# Altium schematic sheet Multi_Pitch_Sound_Generator_Project.SchDoc
size A4; SheetNumber: 1; SheetTotal: 1
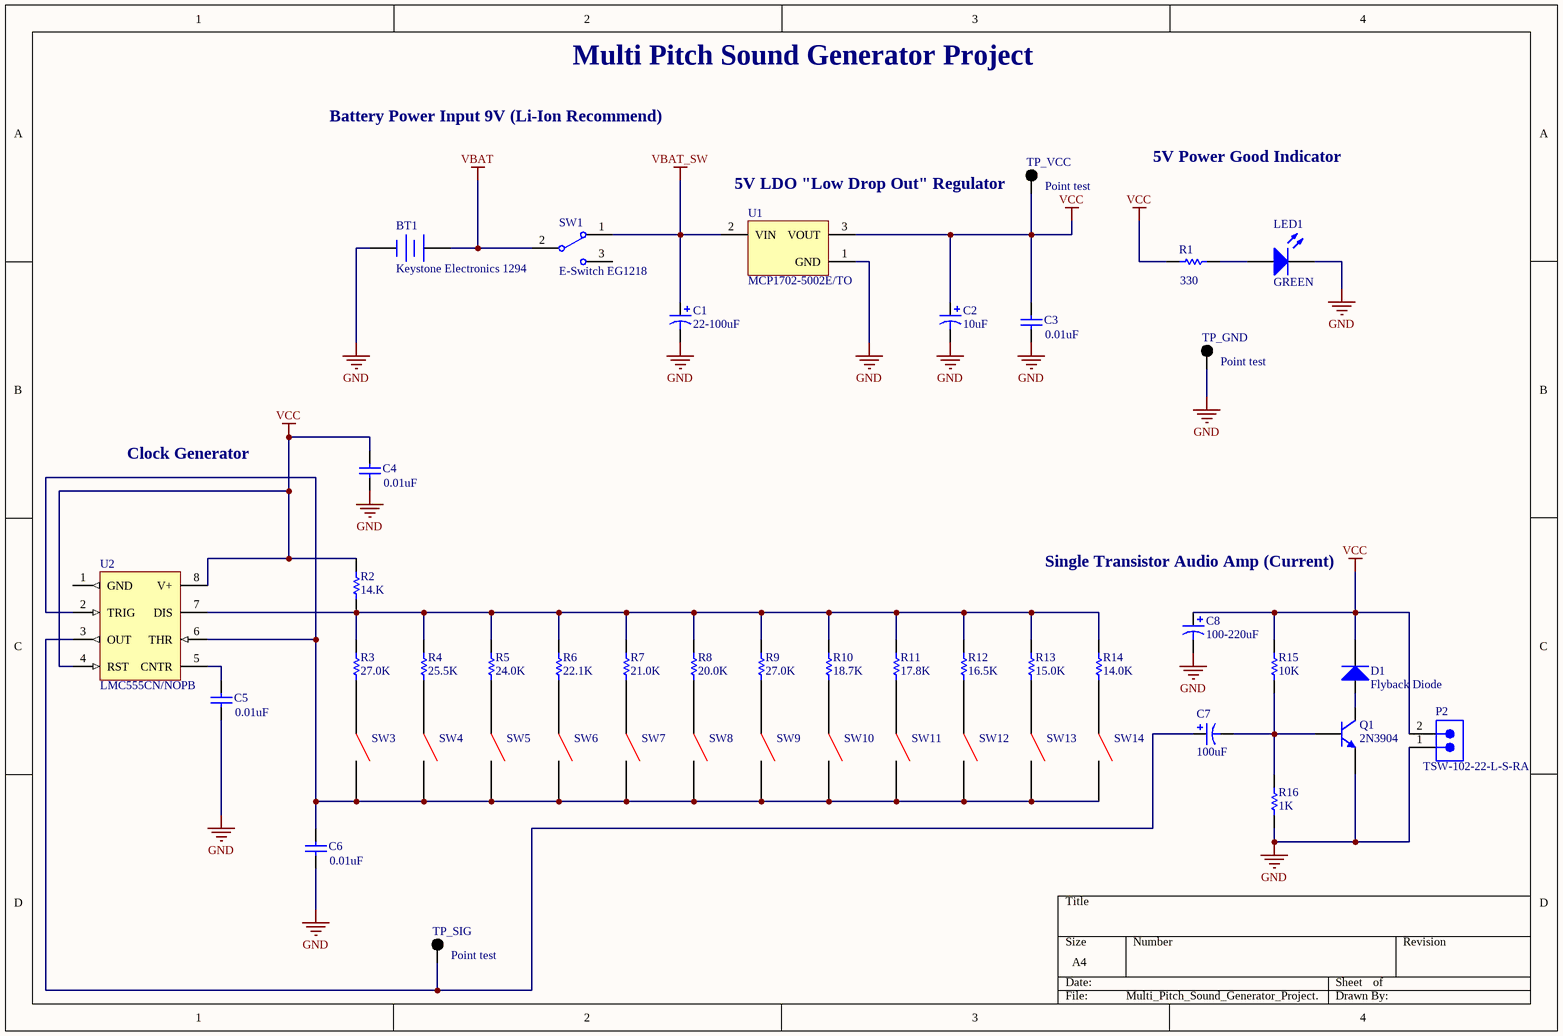
[diagram p0: Multi_Pitch_Sound_Generator_Project.SchDoc]

## Parts
BT1  Keystone Electronics 1294  [PCB-3798-1]
C1  22-100uF  [PCB-nq6yd78wv7rl8ojp8omb-1]
C2  10uF  [PCB-nq6yd78wv7rl8ojp8omb-1]
C3  0.01uF  [PCB-ql28fbuo3tond8refhb5-1]
C4  0.01uF  [PCB-ql28fbuo3tond8refhb5-1]
C5  0.01uF  [PCB-ql28fbuo3tond8refhb5-1]
C6  0.01uF  [PCB-ql28fbuo3tond8refhb5-1]
C7  100uF  [PCB-nq6yd78wv7rl8ojp8omb-1]
C8  100-220uF  [PCB-nq6yd78wv7rl8ojp8omb-1]
D1  Flyback Diode  [PCB-z2ypi7zr74mzpyjelpsh-1]
LED1  GREEN  [PCB-b5vk7vz0xhkw7l0fnova-1]
P2  TSW-102-22-L-S-RA  [SMTC-TSW-102-22-X-S-RA]
Q1  2N3904  [PCB-d52vzgbszc9onplxz1b0-1]
R1  330  [PCB-0jk5y5qyb1smy9vf6b7t-1]
R2  14.K  [PCB-0jk5y5qyb1smy9vf6b7t-1]
R3  27.0K  [PCB-0jk5y5qyb1smy9vf6b7t-1]
R4  25.5K  [PCB-0jk5y5qyb1smy9vf6b7t-1]
R5  24.0K  [PCB-0jk5y5qyb1smy9vf6b7t-1]
R6  22.1K  [PCB-0jk5y5qyb1smy9vf6b7t-1]
R7  21.0K  [PCB-0jk5y5qyb1smy9vf6b7t-1]
R8  20.0K  [PCB-0jk5y5qyb1smy9vf6b7t-1]
R9  27.0K  [PCB-0jk5y5qyb1smy9vf6b7t-1]
R10  18.7K  [PCB-0jk5y5qyb1smy9vf6b7t-1]
R11  17.8K  [PCB-0jk5y5qyb1smy9vf6b7t-1]
R12  16.5K  [PCB-0jk5y5qyb1smy9vf6b7t-1]
R13  15.0K  [PCB-0jk5y5qyb1smy9vf6b7t-1]
R14  14.0K  [PCB-0jk5y5qyb1smy9vf6b7t-1]
R15  10K  [PCB-0jk5y5qyb1smy9vf6b7t-1]
R16  1K  [PCB-0jk5y5qyb1smy9vf6b7t-1]
SW1  E-Switch EG1218  [ESWI-EG1218_V]
SW3  (no value)  [PCB-je10m8m3eogq13l465bo-1]
SW4  (no value)  [PCB-je10m8m3eogq13l465bo-1]
SW5  (no value)  [PCB-je10m8m3eogq13l465bo-1]
SW6  (no value)  [PCB-je10m8m3eogq13l465bo-1]
SW7  (no value)  [PCB-je10m8m3eogq13l465bo-1]
SW8  (no value)  [PCB-je10m8m3eogq13l465bo-1]
SW9  (no value)  [PCB-je10m8m3eogq13l465bo-1]
SW10  (no value)  [PCB-je10m8m3eogq13l465bo-1]
SW11  (no value)  [PCB-je10m8m3eogq13l465bo-1]
SW12  (no value)  [PCB-je10m8m3eogq13l465bo-1]
SW13  (no value)  [PCB-je10m8m3eogq13l465bo-1]
SW14  (no value)  [PCB-je10m8m3eogq13l465bo-1]
TP_GND  Point test  [P1-09]
TP_SIG  Point test  [P1-09]
TP_VCC  Point test  [P1-09]
U1  MCP1702-5002E/TO  [TO-92-TO3]
U2  LMC555CN/NOPB  [TI-D8_L]

## Nets
GND: BT1.2(-) C1.2 C2.2 C3.1 C4.1 C5.1 C6.1 C8.2 LED1.1(K) P2.1 Q1.E R16.2 TP_GND.1 U1.1(GND)
VBAT: BT1.1(+) SW1.2(COM)
VBAT_SW: C1.1 SW1.1 U1.2(VIN)
VCC: C2.1 C3.2 C4.2 C8.1 D1.2(K) P2.2 R1.1 R2.1 R15.1 TP_VCC.1 U1.3(VOUT) U2.4(RST) U2.8(V+)
NetC5_2: C5.2 U2.5(CNTR)
NetC6_2: C6.2 SW3.2 SW4.2 SW5.2 SW6.2 SW7.2 SW8.2 SW9.2 SW10.2 SW11.2 SW12.2 SW13.2 SW14.2 U2.2(TRIG) U2.6(THR)
NetC7_1: C7.1 TP_SIG.1 U2.3(OUT)
NetC7_2: C7.2 Q1.B R15.2 R16.1
NetD1_1: D1.1(A) Q1.C
NetLED1_2: LED1.2(A) R1.2
NetR2_2: R2.2 R3.1 R4.1 R5.1 R6.1 R7.1 R8.1 R9.1 R10.1 R11.1 R12.1 R13.1 R14.1 U2.7(DIS)
NetR3_2: R3.2 SW3.1
NetR4_2: R4.2 SW4.1
NetR5_2: R5.2 SW5.1
NetR6_2: R6.2 SW6.1
NetR7_2: R7.2 SW7.1
NetR8_2: R8.2 SW8.1
NetR9_2: R9.2 SW9.1
NetR10_2: R10.2 SW10.1
NetR11_2: R11.2 SW11.1
NetR12_2: R12.2 SW12.1
NetR13_2: R13.2 SW13.1
NetR14_2: R14.2 SW14.1

Not connected (* = marked no-connect by the designer): SW1 3; U2 1(GND)

## Notes on the sheet
- Multi Pitch Sound Generator Project
- Battery Power Input 9V (Li-Ion Recommend)
- 5V Power Good Indicator
- 5V LDO "Low Drop Out" Regulator
- Clock Generator
- Single Transistor Audio Amp (Current)

## Library data of the parts
BT1 = CMP-3798-4: HOLDER BATT 9V UNIV PLASTIC PC; Manufacturer Part Number: 1294; Lead-Free Status: Lead Free; Number of Contacts: 2; Octopart Url: https://octopart.com/1294-keystone-3743; Material: Plastic; REACH SVHC Compliance: No SVHC; Contact Plating: Nickel; RoHS: Compliant; Packaging: Bulk; OctopartID: fd44344ed6bd2283; Contact Material: Steel
C1 C2 C7 C8 = CMP-119dd9bbe86bce5a-2: Cap Aluminum 10uF 16V 20% (4 X 7mm) Cylindrical 18mA 7000 hr 105°C T/R; Manufacturer Part Number: UCB1C100MCL1GS; Voltage Rating (DC): 16.0 V; Capacitance: 10.0 F; Capacitance Tolerance: ±20%; Size-Diameter: 4.00 mm; Packaging: Tape & Reel (TR); RoHS: Compliant; Octopart URL: http://octopart.com/ucb1c100mcl1gs-nichicon-19717264; OctopartID: 119dd9bbe86bce5a; Size-Height: 7.00 mm; Mounting Style: Surface Mount
C3-C6 = CMP-1272d9258f2acdb5-7: K 100nF Ceramic Multilayer Capacitor, 50 V dc, +125degC, X7R Dielectric, +/-10%
D1 = CMP-816519-3: Standard Recovery Rectifier, 2-Pin Axial_Lead, Pb-Free, Tape and Reel; Manufacturer Part Number: 1N4001RLG; Voltage Rating (DC): 50.0 V; Current Rating: 1.0 A; Lead-Free Status: Lead Free; Number of Pins: 2; RoHS: Compliant; Packaging: Cut Tape (CT); Case/Package: DO-41; Mounting Style: Axial; REACH SVHC Compliance: No SVHC; Octopart Url: https://octopart.com/1n4001rlg-on+semiconductor-322109; OctopartID: 8cde45d043855319; Halogen Free Status: Halogen Free; Lifecycle Status: Active; Polarity: Standard
LED1 = CMP-92bb5b2eff764d7c-3: LED Uni-Color Green 2-Pin T-1 3/4 Bulk; Manufacturer Part Number: C503B-GCN-CY0C0791; Manufacturer: Cree; Wavelength: 527 nm; Luminous Intensity: 12.5 cd; Viewing Angle: 30 °; Forward Voltage: 3.20 V; Octopart URL: http://octopart.com/c503b-gcn-cy0c0791-cree-10438827; OctopartID: 92bb5b2eff764d7c; RoHS: Compliant; Color: Green; Mounting Style: Through Hole; Number of Pins: 2
P2 = CMP-668697-2: 0.025" SQ Post Header, Through-hole, Right Angle, -55 to 125 degC, 2.54 mm Pitch, 2-Pin, Male, RoHS; Number of Contacts: 2; Pin Pitch: 0.00254 m; Manufacturer Part Number: TSW-102-22-L-S-RA; Contact Material: Phosphor Bronze; Contact Plating: Gold; Gender: Male; Mounting Style: Through Hole; Number of Rows: 1; Octopart Url: https://octopart.com/tsw-102-22-l-s-ra-samtec-11758137; OctopartID: 0b86c23f44d9d441; REACH SVHC Compliance: No SVHC; RoHS: Compliant
Q1 = CMP-6928a0272c0fb6ef-18: Transistor General Purpose BJT NPN 40 Volt 0.2 Amp 3-Pin TO-92 Tape And Reel; Manufacturer Part Number: 2N3904TF; Lead-Free Status: Lead Free; Voltage Rating (DC): 40.0 V; Current Rating: 200 mA; Power Dissipation: 625 mW (max); Polarity: NPN, N-Channel; Lifecycle Status: Active; Operating Temperature: 150 °C (max); REACH SVHC Compliance: No SVHC; Footprint: PCB-0sfpb0c87ousukqjmm98-8; OctopartID: 3e48f245e130e18f; Mounting Style: Through Hole; Packaging: Tape; Number of Pins: 3; RoHS: Compliant; Octopart URL: https://octopart.com/2n3904tf-on+semiconductor-84408862; Case/Package: TO-92
R1-R16 = CMP-db3e1311f37e04f9-11: Res, 1K, 250mW, 5%, Axial
SW1 = CMP-9a5a5340a2f5459d-9: Slide Switch, 500 V, -20 to 70 degC, 3-Pin THD, RoHS; Contacts Type: SPDT; Current Rating: 200 mA; Lead-Free Status: Lead Free; Actuator Type: Standard; Number of Positions: 2; Contact Plating: Silver; Mounting Style: PCB, Through Hole; DatasheetVersion: Oct-15; Size-Height: 5.40 mm; Seller Landing  Url: https://octopart-clicks.com/click/track?country=US&ak=8157f166&sig=0e9adab&sid=459&ppid=1056201&vpid=1179261&ct=offers; Size-Width: 4.00 mm; OctopartID: 9a5a5340a2f5459d; RoHS: Compliant; Contact Material: Copper Alloy; Manufacturer Part Number: EG1218; Orientation: Vertical; PackageReference: EG1218; Octopart Url: http://octopart.com/eg1218-e-switch-1056201; Size-Length: 2.03 mm; PackageDescription: 3-Pin Through Hole Device, Body 11.6 x 4 mm, Pitch 2.5 mm; Packaging: Bulk
SW3-SW14 = CMP-2fe5e5be239cf022-2: Switch Tactile N.O. SPST Round Button PC Pins 0.02A 15VDC 1.3N Thru-Hole Radial T/R; Manufacturer Part Number: EVQ-21405R; Actuator Type: Standard; Contacts Type: SPST-NO; Lead-Free Status: Lead Free; Contact Current Rating: 20.0 mA; Element14 Part No.: 2281982; RoHS: Compliant; Size-Width: 6.00 mm; Octopart URL: http://octopart.com/evq-21405r-panasonic-55650591; Size-Length: 6.00 mm; Mounting Style: Through Hole, PC Board; Element14 Min Order: 1; Element14 Price Per: $0.109; Lifecycle Status: Not Listed by Manufacturer; Element14 URL: http://au.element14.com/panasonic-electronic-components/evq-21405r/switch-tactile-spst-no-20ma-15vdc/dp/2281982; OctopartID: 2fe5e5be239cf022; Packaging: Tape & Reel (TR); Orientation: Vertical
TP_GND TP_SIG TP_VCC = CMP-954154-32: KEYSTONE   5001   TEST POINT, PCB, THROUGH HOLE
U1 = CMP-1493418-2: 250 mA Low Quiescent Current LDO Regulator, 3-Pin TO-92, Extended TemperatureBAG; Dropout Voltage: 0.33 V; Lead-Free Status: Lead Free; Number of Outputs: 1; Output Voltage: 5.0 V; Quiescent Current: 2e-06 A; Manufacturer Part Number: MCP1702-5002E/TO; Case/Package: TO-92; Lifecycle Status: Active; Mounting Style: Through Hole; Number of Pins: 3; Octopart Url: https://octopart.com/mcp1702-5002e%2Fto-microchip-535762; OctopartID: b1707872b8c46eb7; Packaging: Bulk; REACH SVHC Compliance: No SVHC; RoHS: Compliant
U2 = CMP-6f1ca76cec01b0db-1: World’s smallest 555 timer with low power, high accuracy and a Fmax of 3MHz 8-SOIC -40 to 85; Manufacturer Part Number: LMC555CMX/NOPB; Supply Voltage (DC): 1.50 V (min), 2.00 V (min), 15.0 V (max); Frequency: 3.00 MHz; Input Voltage (DC): 12.0 V (max); Output Current: 100 mA (max); Lead-Free Status: Lead Free; Quiescent Current: 50.0 µA; Footprint: PCC-0151-00063-2; Case/Package: SOIC; RoHS: Compliant; Octopart URL: https://octopart.com/lmc555cmx%2Fnopb-texas+instruments-24815227; Number of Pins: 8; Mounting Style: Surface Mount; OctopartID: 6f1ca76cec01b0db; REACH SVHC Compliance: No SVHC; Operating Temperature: -40.0 °C (min); Packaging: Cut Tape (CT), Reel, Tape & Reel (TR); Lifecycle Status: Active